# EAGLE design Phoreo (EAGLE 9.6.2)
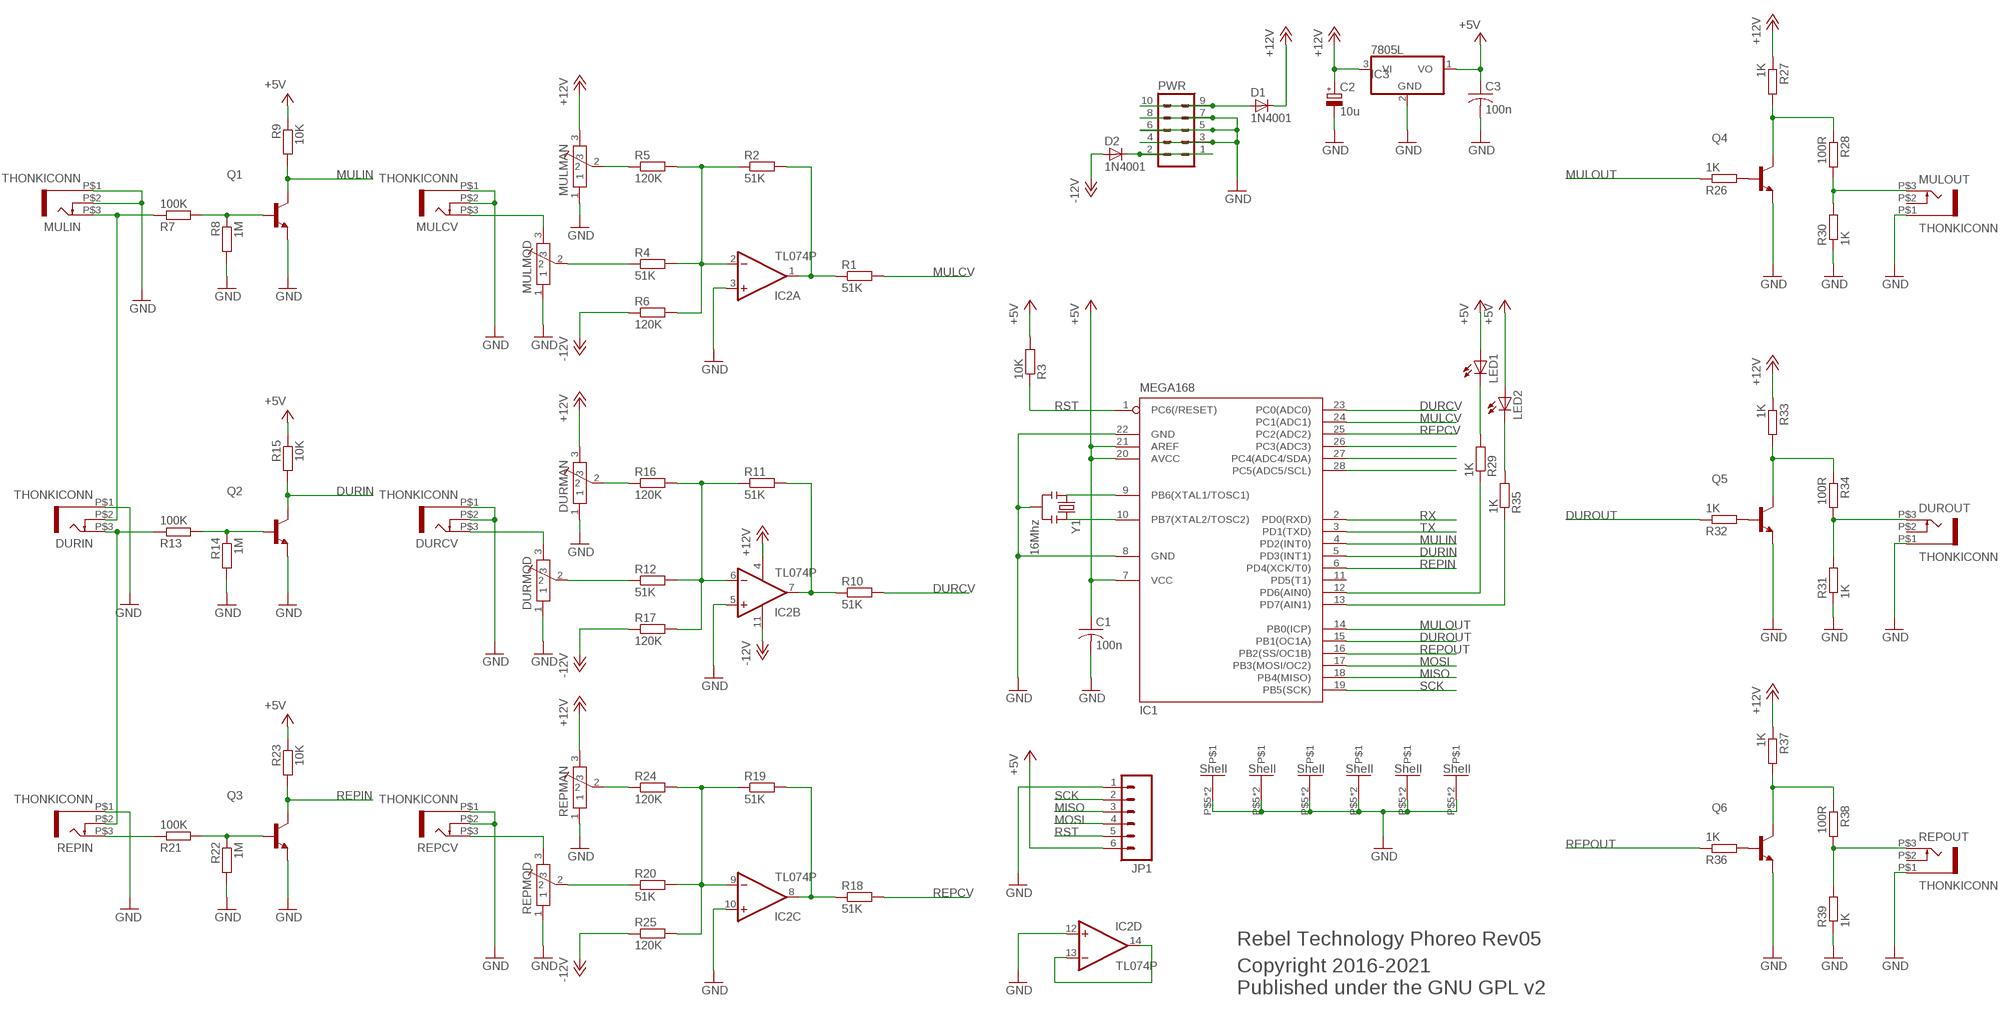
[diagram p0: schematic, sheet 1]

## Parts
C1  100n  C-US050-024X044  [C050-024X044]
C2  10u  CPOL-EUE5-6  [E5-6]
C3  100n  C-US050-024X044  [C050-024X044]
D1  1N4001  DIODE1N4001  [DIODE-1N4001]
D2  1N4001  DIODE1N4001  [DIODE-1N4001]
DURCV  THONKICONN  [THONKICONN]
DURIN  THONKICONN  [THONKICONN]
DURMAN  POT-ALPS-RK09L1140  [POT-ALPS-RK09L1140]
DURMOD  POT-ALPS-RK09L1140  [POT-ALPS-RK09L1140]
DUROUT  THONKICONN  [THONKICONN]
IC1  MEGA168  MEGA8-P  [DIL28-3]
IC2  TL074P  [DIL14]
IC3  7805L  [TO92]
JP1  M06SIP  [1X06]
LED1  LED3MM  [LED3MM]
LED2  LED3MM  [LED3MM]
MULCV  THONKICONN  [THONKICONN]
MULIN  THONKICONN  [THONKICONN]
MULMAN  POT-ALPS-RK09L1140  [POT-ALPS-RK09L1140]
MULMOD  POT-ALPS-RK09L1140  [POT-ALPS-RK09L1140]
MULOUT  THONKICONN  [THONKICONN]
PWR  MA05-2  [MA05-2]
Q1  2N3904-NPN-TO92-EBC  [TO92-EBC]
Q2  2N3904-NPN-TO92-EBC  [TO92-EBC]
Q3  2N3904-NPN-TO92-EBC  [TO92-EBC]
Q4  2N3904-NPN-TO92-EBC  [TO92-EBC]
Q5  2N3904-NPN-TO92-EBC  [TO92-EBC]
Q6  2N3904-NPN-TO92-EBC  [TO92-EBC]
R1  51K  R-EU_0204/7  [0204/7]
R2  51K  R-EU_0204/7  [0204/7]
R3  10K  R-EU_0204/7  [0204/7]
R4  51K  R-EU_0204/7  [0204/7]
R5  120K  R-EU_0204/7  [0204/7]
R6  120K  R-EU_0204/7  [0204/7]
R7  100K  R-EU_0204/7  [0204/7]
R8  1M  R-EU_0204/7  [0204/7]
R9  10K  R-EU_0204/7  [0204/7]
R10  51K  R-EU_0204/7  [0204/7]
R11  51K  R-EU_0204/7  [0204/7]
R12  51K  R-EU_0204/7  [0204/7]
R13  100K  R-EU_0204/7  [0204/7]
R14  1M  R-EU_0204/7  [0204/7]
R15  10K  R-EU_0204/7  [0204/7]
R16  120K  R-EU_0204/7  [0204/7]
R17  120K  R-EU_0204/7  [0204/7]
R18  51K  R-EU_0204/7  [0204/7]
R19  51K  R-EU_0204/7  [0204/7]
R20  51K  R-EU_0204/7  [0204/7]
R21  100K  R-EU_0204/7  [0204/7]
R22  1M  R-EU_0204/7  [0204/7]
R23  10K  R-EU_0204/7  [0204/7]
R24  120K  R-EU_0204/7  [0204/7]
R25  120K  R-EU_0204/7  [0204/7]
R26  1K  R-EU_0204/7  [0204/7]
R27  1K  R-EU_0204/7  [0204/7]
R28  100R  R-EU_0204/7  [0204/7]
R29  1K  R-EU_0204/7  [0204/7]
R30  1K  R-EU_0204/7  [0204/7]
R31  1K  R-EU_0204/7  [0204/7]
R32  1K  R-EU_0204/7  [0204/7]
R33  1K  R-EU_0204/7  [0204/7]
R34  100R  R-EU_0204/7  [0204/7]
R35  1K  R-EU_0204/7  [0204/7]
R36  1K  R-EU_0204/7  [0204/7]
R37  1K  R-EU_0204/7  [0204/7]
R38  100R  R-EU_0204/7  [0204/7]
R39  1K  R-EU_0204/7  [0204/7]
REPCV  THONKICONN  [THONKICONN]
REPIN  THONKICONN  [THONKICONN]
REPMAN  POT-ALPS-RK09L1140  [POT-ALPS-RK09L1140]
REPMOD  POT-ALPS-RK09L1140  [POT-ALPS-RK09L1140]
REPOUT  THONKICONN  [THONKICONN]
Y1  16Mhz  RESONATORPTH  [RESONATOR-PTH]

## Nets
+5V: C1.1 C3.1 IC1.7(VCC) IC1.20(AVCC) IC1.21(AREF) IC3.1(VO) JP1.6 LED1.A LED2.A R3.2 R9.1 R15.1 R23.1
+12V: C2.+ D1.C DURMAN.3 IC2.4(P:V+) IC3.3(VI) MULMAN.3 R27.1 R33.1 R37.1 REPMAN.3
-12V: D2.A IC2.11(P:V-) R6.1 R17.1 R25.1
DURCV: IC1.23(PC0(ADC0)) R10.2
DURIN: IC1.5(PD3(INT1)) Q2.C R15.2
DUROUT: IC1.15(PB1(OC1A)) R32.1
DURSW: DURIN.P$2 MULIN.P$3 R7.1
GND: C1.2 C2.- C3.2 DURCV.P$1 DURCV.P$2 DURIN.P$1 DURMAN.1 DURMAN.P$5 DURMAN.P$6 DURMOD.1 DURMOD.P$5 DURMOD.P$6 DUROUT.P$1 IC1.8(GND) IC1.22(GND) IC2.3(A:+IN) IC2.5(B:+IN) IC2.10(C:+IN) IC2.12(D:+IN) IC3.2(GND) JP1.1 MULCV.P$1 MULCV.P$2 MULIN.P$1 MULIN.P$2 MULMAN.1 MULMAN.P$5 MULMAN.P$6 MULMOD.1 MULMOD.P$5 MULMOD.P$6 MULOUT.P$1 PWR.3 PWR.4 PWR.5 PWR.6 PWR.7 PWR.8 Q1.E Q2.E Q3.E Q4.E Q5.E Q6.E R8.2 R14.2 R22.2 R30.1 R31.1 R39.1 REPCV.P$1 REPCV.P$2 REPIN.P$1 REPMAN.1 REPMAN.P$5 REPMAN.P$6 REPMOD.1 REPMOD.P$5 REPMOD.P$6 REPOUT.P$1 Y1.2
MISO: IC1.18(PB4(MISO)) JP1.3
MOSI: IC1.17(PB3(MOSI/OC2)) JP1.4
MULCV: IC1.24(PC1(ADC1)) R1.2
MULIN: IC1.4(PD2(INT0)) Q1.C R9.2
MULOUT: IC1.14(PB0(ICP)) R26.1
N$1: DURCV.P$3 DURMOD.3
N$2: IC2.6(B:-IN) R11.1 R12.2 R16.2 R17.2
N$3: DURMAN.2 R16.1
N$4: IC2.7(B:OUT) R10.1 R11.2
N$5: DURMOD.2 R12.1
N$7: IC2.9(C:-IN) R19.1 R20.2 R24.2 R25.2
N$8: R24.1 REPMAN.2
N$9: IC2.8(C:OUT) R18.1 R19.2
N$10: R20.1 REPMOD.2
N$11: IC2.13(D:-IN) IC2.14(D:OUT)
N$12: REPCV.P$3 REPMOD.3
N$13: IC1.26(PC3(ADC3))
N$14: IC1.27(PC4(ADC4/SDA))
N$15: IC1.28(PC5(ADC5/SCL))
N$16: IC2.2(A:-IN) R2.1 R4.2 R5.2 R6.2
N$17: MULMAN.2 R5.1
N$18: IC2.1(A:OUT) R1.1 R2.2
N$19: MULMOD.2 R4.1
N$20: IC1.9(PB6(XTAL1/TOSC1)) Y1.1
N$21: IC1.10(PB7(XTAL2/TOSC2)) Y1.3
N$22: MULCV.P$3 MULMOD.3
N$23: LED1.K(C) R29.2
N$24: LED2.K(C) R35.2
N$25: IC1.13(PD7(AIN1)) R35.1
N$26: Q5.B R32.2
N$27: Q1.B R7.2 R8.1
N$28: MULOUT.P$3 R28.2 R30.2
N$29: IC1.12(PD6(AIN0)) R29.1
N$30: DUROUT.P$3 R31.2 R34.2
N$31: Q2.B R13.2 R14.1
N$32: Q5.C R33.2 R34.1
N$33: Q4.B R26.2
N$34: Q6.B R36.2
N$35: R38.2 R39.2 REPOUT.P$3
N$36: DURIN.P$3 R13.1 REPIN.P$2
N$37: Q4.C R27.2 R28.1
N$38: Q6.C R37.2 R38.1
N$39: Q3.B R21.2 R22.1
N$40: D1.A PWR.9 PWR.10
N$41: R21.1 REPIN.P$3
N$42: D2.C PWR.1 PWR.2
REPCV: IC1.25(PC2(ADC2)) R18.2
REPIN: IC1.6(PD4(XCK/T0)) Q3.C R23.2
REPOUT: IC1.16(PB2(SS/OC1B)) R36.1
RST: IC1.1(PC6(/RESET)) JP1.5 R3.1
RX: IC1.2(PD0(RXD))
SCK: IC1.19(PB5(SCK)) JP1.2
TX: IC1.3(PD1(TXD))
Unconnected: DUROUT.P$2 IC1.11(PD5(T1)) MULOUT.P$2 REPOUT.P$2

## Notes on the sheet
- Rebel Technology Phoreo Rev05
- Copyright 2016-2021
  Published under the GNU GPL v2

## Library data of the parts
C1 C3 = rcl:C-US: CAPACITOR, American symbol
C2 = rcl:CPOL-EU: POLARIZED CAPACITOR, European symbol
D1 D2 = Rebel:DIODE: Diode
DURCV DURIN DUROUT MULCV MULIN MULOUT REPCV REPIN REPOUT = Rebel:THONKICONN
DURMAN DURMOD MULMAN MULMOD REPMAN REPMOD = Rebel:POT-ALPS-RK09L
IC1 = atmel:MEGA8-P: MICROCONTROLLER 8 Kbytes FLASH, 1 kbytes SRAM, 512 bytes EEPROM, USART, 4-channel 10 bit ADC, 2-channel 8 bit ADC Pin compatible with Atmega48, ATMega88, ATMega168 Source: avr.lbr; OC_FARNELL: unknown; OC_NEWARK: unknown
IC2 = linear:TL074: OP AMP
IC3 = linear:78*: Positive VOLTAGE REGULATOR Source: http://cache.national.com/ds/LM/LM78L05.pdf http://www.fairchildsemi.com/ds/LM/LM7805.pdf
JP1 = SparkFun:M06: Header 6 Standard 6-pin 0.1" header. Use with straight break away headers (SKU : PRT-00116), right angle break away headers (PRT-00553), swiss pins (PRT-00743), machine pins (PRT-00117), and female headers (PRT-00115). Molex polarized connector foot print use with SKU : PRT-08094 with associated crimp pins and housings. NOTES ON THE VARIANTS LOCK and LOCK_LONGPADS... This footprint was designed to help hold the alignment of a through-hole component (i.e. 6-pin header) while soldering it into place. You may notice that each hole has been shifted either up or down by 0.005 of an inch from it's more standard position (which is a perfectly straight line). This slight alteration caused the pins (the squares in the middle) to touch the edges of the holes. Because they are alternating, it causes a "brace" to hold the component in place. 0.005 has proven to be the perfect amount of "off-center" position when using our standard breakaway headers. Although looks a little odd when you look at the bare footprint, once you have a header in there, the alteration is very hard to notice. Also, if you push a header all the way into place, it is covered up entirely on the bottom side. This idea of altering the position of holes to aid alignment will be further integrated into the Sparkfun Library for other footprints. It can help hold any component with 3 or more connection pins.
LED1 LED2 = Rebel:LED: LED OSRAM: - CHIPLED LG R971, LG N971, LY N971, LG Q971, LY Q971, LO R971, LY R971 LH N974, LH R974 LS Q976, LO Q976, LY Q976 LO Q996 - Hyper CHIPLED LW Q18S LB Q993, LB Q99A, LB R99A - SideLED LS A670, LO A670, LY A670, LG A670, LP A670 LB A673, LV A673, LT A673, LW A673 LH A674 LY A675 LS A676, LA A676, LO A676, LY A676, LW A676 LS A679, LY A679, LG A679 - Hyper Micro SIDELED® LS Y876, LA Y876, LO Y876, LY Y876 LT Y87S - SmartLED LW L88C, LW L88S LB L89C, LB L89S, LG L890 LS L89K, LO L89K, LY L89K LS L896, LA L896, LO L896, LY L896 - TOPLED LS T670, LO T670, LY T670, LG T670, LP T670 LSG T670, LSP T670, LSY T670, LOP T670, LYG T670 LG T671, LOG T671, LSG T671 LB T673, LV T673, LT T673, LW T673 LH T674 LS T676, LA T676, LO T676, LY T676, LB T676, LH T676, LSB T676, LW T676 LB T67C, LV T67C, LT T67C, LS T67K, LO T67K, LY T67K, LW E67C LS E67B, LA E67B, LO E67B, LY E67B, LB E67C, LV E67C, LT E67C LW T67C LS T679, LY T679, LG T679 LS T770, LO T770, LY T770, LG T770, LP T770 LB T773, LV T773, LT T773, LW T773 LH T774 LS E675, LA E675, LY E675, LS T675 LS T776, LA T776, LO T776, LY T776, LB T776 LHGB T686 LT T68C, LB T68C - Hyper Mini TOPLED® LB M676 - Mini TOPLED Santana® LG M470 LS M47K, LO M47K, LY M47K Source: http://www.osram.convergy.de LUXEON: - LUMILED® LXK2-PW12-R00, LXK2-PW12-S00, LXK2-PW14-U00, LXK2-PW14-V00 LXK2-PM12-R00, LXK2-PM12-S00, LXK2-PM14-U00 LXK2-PE12-Q00, LXK2-PE12-R00, LXK2-PE12-S00, LXK2-PE14-T00, LXK2-PE14-U00 LXK2-PB12-K00, LXK2-PB12-L00, LXK2-PB12-M00, LXK2-PB14-N00, LXK2-PB14-P00, LXK2-PB14-Q00 LXK2-PR12-L00, LXK2-PR12-M00, LXK2-PR14-Q00, LXK2-PR14-R00 LXK2-PD12-Q00, LXK2-PD12-R00, LXK2-PD12-S00 LXK2-PH12-R00, LXK2-PH12-S00 LXK2-PL12-P00, LXK2-PL12-Q00, LXK2-PL12-R00 Source: www.luxeon.com KINGBRIGHT: KA-3528ASYC Source: www.kingbright.com
PWR = Rebel:MA05-2: PIN HEADER; OC_FARNELL: unknown; OC_NEWARK: unknown
Q1-Q6 = transistor-neu-to92:*-NPN-: NPN Transistror
R1-R39 = Rebel:R-EU_: RESISTOR, European symbol
Y1 = SparkFun:RESONATOR: Resonator Small SMD resonator. This is the itty bitty 10/20MHz resonators with built in caps. CSTCE10M0G55 and CSTCE20M0V53. Footprint has been reviewed closely but hasn't been tested yet.

## Board
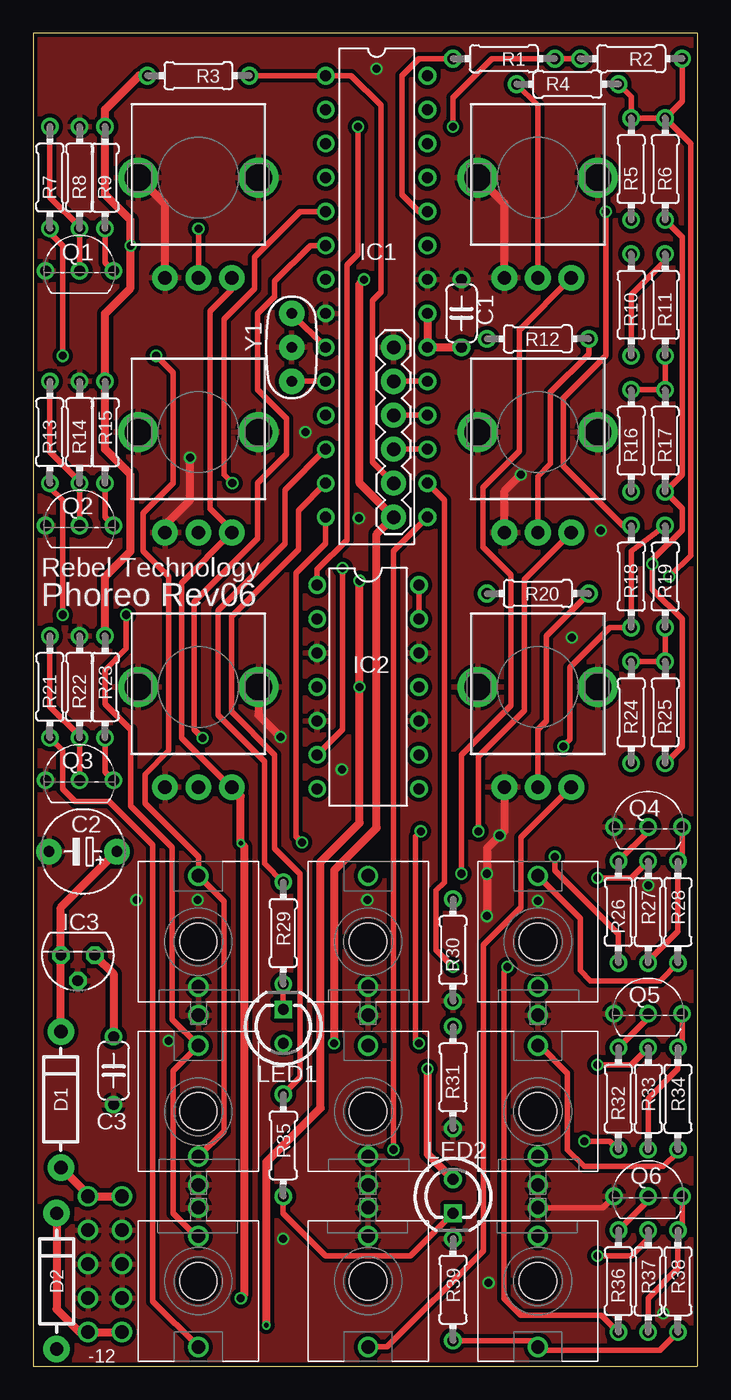
[diagram p1: board, top side]
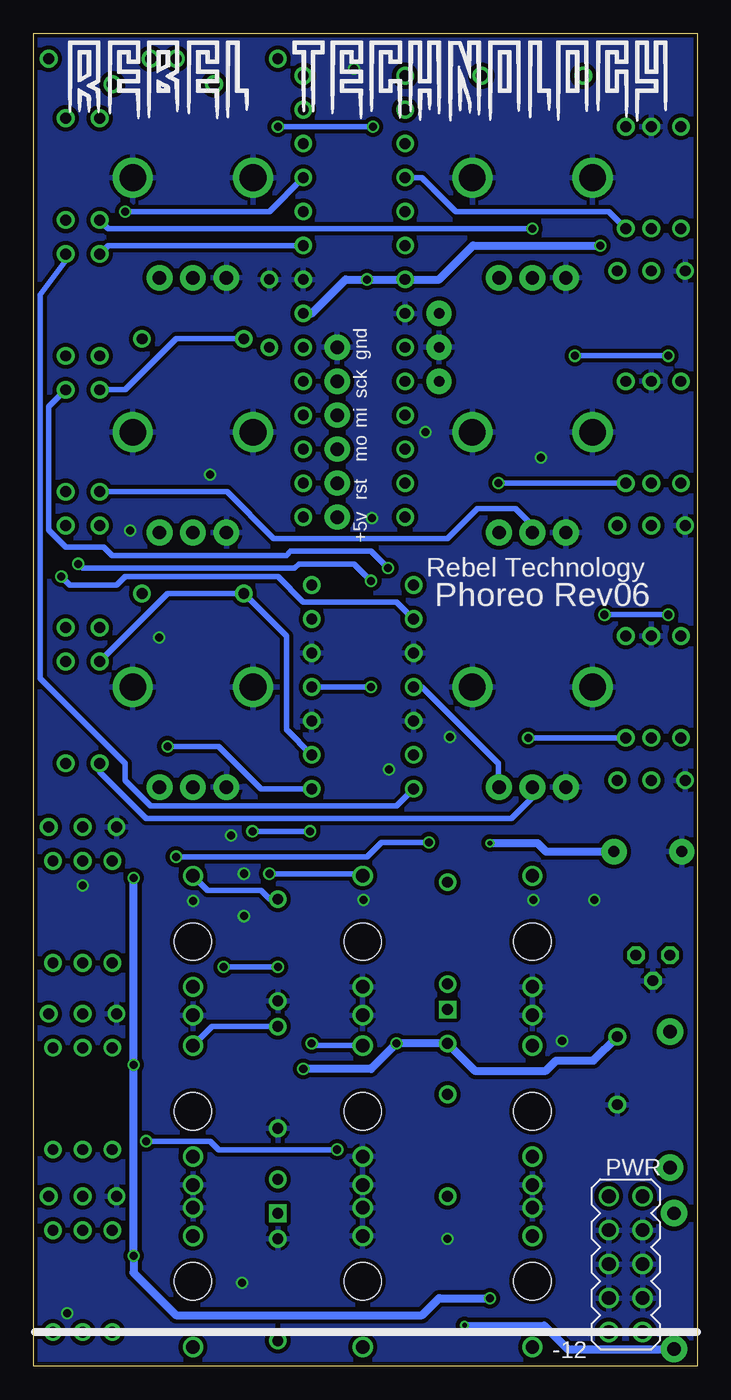
[diagram p2: board, bottom side, seen from below]

Size 49.68 x 99.68 mm. Coordinates in mm from the lower left corner, seen from the top.
Outline: 49.68,99.68 0,99.68 0,0 49.68,0 49.68,99.68
Copper layers (1*16): Top 0.035mm / dielectric 1.5mm / Bottom 0.035mm
Design rules "Fusion_eagle_rule_v1.1 *": minimum track width 6mil, minimum drill 12mil, track to track 6mil, track to pad 6mil, pad to pad 6mil, via to via 6mil, smd to smd 0mil, copper to edge 8mil, drill to drill 8mil, minimum pad ring 10mil, minimum via ring 6mil, stop-mask expansion 2mil, vias tented up to drill 100mil, thermal gap 10mil

### Footprints (pad centres in the part's own frame; a part is rotated, then mirrored left to right if it is on the bottom)
C050-024X044 = drill 0.813: 1 -2.54,0; 2 2.54,0
E5-6 = drill 0.813 pad 1.905: + -2.54,0; - 2.54,0
DIODE-1N4001 = drill 1 pad 1.981: A -5.08,0; C 5.08,0
THONKICONN = drill 1: P$1 0,-5.5; P$2 0,-3.38; P$3 0,4.92 | hole 2.8: 0,0
POT-ALPS-RK09L1140 = drill 1 pad 1.93: 1 -2.5,-7.5; 2 0,-7.5; 3 2.5,-7.5 | drill 2: P$5 -4.5,0; P$6 4.5,0
DIL28-3 = drill 0.813: 1 -16.51,-3.81; 2 -13.97,-3.81; 3 -11.43,-3.81; 4 -8.89,-3.81; 5 -6.35,-3.81; 6 -3.81,-3.81; 7 -1.27,-3.81; 8 1.27,-3.81; 9 3.81,-3.81; 10 6.35,-3.81; 11 8.89,-3.81; 12 11.43,-3.81; 13 13.97,-3.81; 14 16.51,-3.81; 15 16.51,3.81; 16 13.97,3.81; 17 11.43,3.81; 18 8.89,3.81; 19 6.35,3.81; 20 3.81,3.81; 21 1.27,3.81; 22 -1.27,3.81; 23 -3.81,3.81; 24 -6.35,3.81; 25 -8.89,3.81; 26 -11.43,3.81; 27 -13.97,3.81; 28 -16.51,3.81
DIL14 = drill 0.813: 1 -7.62,-3.81; 2 -5.08,-3.81; 3 -2.54,-3.81; 4 0,-3.81; 5 2.54,-3.81; 6 5.08,-3.81; 7 7.62,-3.81; 8 7.62,3.81; 9 5.08,3.81; 10 2.54,3.81; 11 0,3.81; 12 -2.54,3.81; 13 -5.08,3.81; 14 -7.62,3.81
TO92 = drill 0.813 octagon: 1 -1.27,0; 2 0,1.905; 3 1.27,0
1X06 = drill 1.016 pad 1.88: 1 0,0; 2 2.54,0; 3 5.08,0; 4 7.62,0; 5 10.16,0; 6 12.7,0
LED3MM = drill 0.813: A -1.27,0 | drill 0.813 square: K 1.27,0
MA05-2 = drill 1.016: 1 -5.08,-1.27; 2 -5.08,1.27; 3 -2.54,-1.27; 4 -2.54,1.27; 5 0,-1.27; 6 0,1.27; 7 2.54,-1.27; 8 2.54,1.27; 9 5.08,-1.27; 10 5.08,1.27
TO92-EBC = drill 0.813: B 0,-1.27; C 2.54,-1.27; E -2.54,-1.27
0204/7 = drill 0.813: 1 -3.81,0; 2 3.81,0
RESONATOR-PTH = drill 0.8 pad 1.88: 1 -2.54,0; 2 0,0; 3 2.54,0

### Placement (x,y rotation side)
C1  32.03,78.74 90 top
C2  3.71,38.48 180 top
C3  5.99,22.1 270 top
D1  2.06,19.94 90 top
D2  1.74,6.35 90 top
DURCV  25.04,19.05 0 top
DURIN  12.34,19.05 0 top
DURMAN  12.34,69.85 0 top
DURMOD  37.74,69.85 0 top
DUROUT  37.74,19.05 0 top
IC1  25.68,80.01 270 top
IC2  25.04,50.8 270 top
IC3  3.33,30.73 180 top
JP1  26.95,76.2 270 top
LED1  18.69,25.4 90 top
LED2  31.39,12.7 270 top
MULCV  25.04,31.75 0 top
MULIN  12.34,31.75 0 top
MULMAN  12.34,88.9 0 top
MULMOD  37.74,88.9 0 top
MULOUT  37.74,31.75 0 top
PWR  5.36,7.62 90 bottom
Q1  3.45,83.19 0 top
Q2  3.45,64.14 0 top
Q3  3.45,45.09 0 top
Q4  46,41.59 0 top
Q5  46,27.62 0 top
Q6  46,13.97 0 top
R1  35.2,97.79 180 top
R2  44.73,97.79 180 top
R3  12.34,96.52 180 top
R4  39.97,95.89 0 top
R5  44.73,89.53 90 top
R6  47.27,89.53 90 top
R7  1.23,88.9 90 top
R8  3.45,88.9 90 top
R9  5.36,88.9 270 top
R10  44.73,79.38 90 top
R11  47.27,79.38 90 top
R12  37.74,76.83 180 top
R13  1.23,69.85 90 top
R14  3.45,69.85 90 top
R15  5.36,69.85 270 top
R16  44.73,69.22 90 top
R17  47.27,69.22 90 top
R18  44.73,59.05 90 top
R19  47.27,59.05 90 top
R20  37.74,57.78 180 top
R21  1.23,50.8 90 top
R22  3.45,50.8 90 top
R23  5.36,50.8 270 top
R24  44.73,48.9 90 top
R25  47.27,48.9 90 top
R26  43.78,33.97 90 top
R27  46,33.97 270 top
R28  48.22,33.97 270 top
R29  18.69,32.38 270 top
R30  31.39,31.11 90 top
R31  31.39,21.59 90 top
R32  43.78,20 90 top
R33  46,20 270 top
R34  48.22,20 270 top
R35  18.69,16.51 270 top
R36  43.78,6.35 90 top
R37  46,6.35 270 top
R38  48.22,6.35 270 top
R39  31.39,5.71 270 top
REPCV  25.04,6.35 180 top
REPIN  12.34,6.35 180 top
REPMAN  12.34,50.8 0 top
REPMOD  37.74,50.8 0 top
REPOUT  37.74,6.35 180 top
Y1  19.33,76.2 270 top

### Tracks (layer width: path | path; a pad name or v marks a point on that pad's centre or on a via)
+5V  (via drill 0.6)
  Top 0.61: R23.1 5.36,59.05 7.26,60.96 7.26,66.67 5.36,68.58 R15.1 5.36,78.74 7.26,80.64 v7.26,83.82 7.26,85.72 5.36,87.63 R9.1 5.36,93.98 7.9,96.52 R3.2 | IC1.21 IC1.20 C1.1 | v22.5,24.13 22.5,37.08 25.68,40.26 25.68,62.23 JP1.6 24.41,66.04 24.41,80.96 v24.73,81.28 | v29.49,22.23 29.49,15.88 LED2.A | IC3.1 5.99,29.34 C3.1
  Bottom 0.61: IC1.21 28.85,78.74 26.31,81.28 v24.73,81.28 IC1.7 19.33,81.28 16.79,83.82 v7.26,83.82 | v29.49,22.23 24.41,22.23 v22.5,24.13 LED1.A 16.66,22.1 11.33,22.1 10.57,22.86 7.77,22.86 C3.1
+12V  (via drill 0.35, 0.6)
  Top 0.406: R37.1 46,9.53 44.73,8.26 v42.19,8.26 | v42.19,22.54 44.73,22.54 R33.1 | v42.19,36.51 44.73,36.51 R27.1 | MULMAN.3 14.84,80.51 13.23,78.9 13.23,64.14 14.84,62.52 DURMAN.3 11.07,58.58 11.07,46.99 14.76,43.3 REPMAN.3
  Top 0.61: v15.52,5.08 15.77,5.33 15.77,38.86 v15.52,39.12 15.52,42.62 REPMAN.3 | D1.C IC3.3 2.06,34.29 C2.+
  Bottom 0.406: IC2.4 20.6,50.8 14.88,45.09 14.88,43.34 REPMAN.3
  Bottom 0.61: v42.19,36.51 v42.19,22.54 v42.19,8.26 42.19,6.99 39.01,3.81 20.6,3.81 19.33,5.08 v15.52,5.08 | C2.+ 11.33,38.48 11.96,39.12 v15.52,39.12
-12V  (via drill 0.35, 0.6)
  Top 0.406: R25.1 48.54,46.35 48.54,55.88 46.32,58.1 v46.32,60.01 46.32,60.33 48.54,62.55 48.54,64.14 R17.1 48.54,66.67 48.54,84.45 R6.1
  Top 0.61: v24.41,58.74 v24.41,50.8 24.41,40.64 21.49,37.72 21.49,19.3 17.42,15.24 v17.42,3.05
  Bottom 0.406: IC2.11 v24.41,50.8 | v24.41,58.74 25.68,60.01 29.81,60.01 30.12,59.69 46,59.69 v46.32,60.01
  Bottom 0.61: v17.42,3.05 17.4,3.02 11.46,3.02 9.71,1.27 D2.A
DURCV
  Bottom 0.406: R10.2 44.09,83.82 IC1.23
DURIN  (via drill 0.6)
  Top 0.406: R15.2 5.36,63.5 Q2.C | IC1.5 19.96,86.36 16.54,82.93 16.54,80.58 14.25,78.3 14.25,66.67 v14.88,66.04
  Bottom 0.406: v14.88,66.04 R15.2
DUROUT  (via drill 0.6)
  Top 0.406: v26.95,16.19 26.95,60.96 IC1.15 | v41.24,16.83 43.14,16.83 R32.1
  Bottom 0.406: v41.24,16.83 36.47,16.83 35.84,16.19 v26.95,16.19
DURSW  (via drill 0.6)
  Top 0.406: DURIN.P$2 14.25,17.57 14.25,34.77 MULIN.P$3 12.34,38.1 8.34,42.1 8.34,44.26 10.12,46.04 10.12,59.05 8.22,60.96 8.22,63.82 10.44,66.04 10.44,74.3 v9.17,75.56 | R7.1 1.23,84.77 2.18,83.82 v2.18,75.56
  Bottom 0.406: v2.18,75.56 v9.17,75.56
GND  (via drill 0.6)
  Top 0.406: REPOUT.P$1 42.61,11.85 Q6.E
  Top 0.61: DURMOD.1 35.24,65.44 v36.47,66.67 | MULMOD.P$5 33.3,88.9 35.2,87 35.2,81.44 MULMOD.1 | MULMAN.P$5 9.84,86.9 MULMAN.1 | DURMAN.1 9.84,62.91 11.71,64.77 v11.71,67.94 | REPMAN.P$6 16.84,48.71 v18.5,47.05 | REPMOD.1 35.24,40.05 v34.89,39.69 33.93,38.73 v33.93,36.83 v33.93,33.66
  other vias: 24.35,63.44 12.28,34.86 24.98,34.86 23.08,44.64 34.06,6.22 37.74,34.8 40.28,54.48 42.44,62.48 25.68,97.03 10.12,24.32 7.71,34.86 20.35,69.85 47.14,3.94 18.69,9.53 46,35.94
  pour Bottom (isolate 0.305): 51.08,-0.64 0.28,-0.64 -0.36,100.97 50.44,100.97
  pour Top (isolate 0.305): 50.44,-1.27 -0.36,-1.27 -0.99,100.33 49.81,100.33
MISO
  Top 0.406: JP1.3 IC1.18
MOSI
  Top 0.406: JP1.4 IC1.17
MULCV
  Top 0.406: IC1.24 28.85,86.36 27.58,87.63 27.58,96.52 28.85,97.79 R1.2
MULIN
  Top 0.406: R9.2 5.36,82.55 Q1.C
  Bottom 0.406: R9.2 6.63,86.36 18.06,86.36 20.6,88.9 IC1.4
MULOUT  (via drill 0.6)
  Top 0.406: R26.1 43.78,32.32 39.01,37.08 v39.01,38.1 | v20.09,39.18 19.65,39.62 19.65,59.31 21.87,61.53 IC1.14
  Bottom 0.406: v39.01,38.1 24.73,38.1 23.65,39.18 v20.09,39.18
N$1  (via drill 0.6)
  Top 0.406: v28.85,24.13 28.6,24.38 28.6,39.62 v28.98,40.01 | v33.3,40.01 33.3,45.59 36.73,49.02 36.73,58.83 DURMOD.3
  Bottom 0.406: DURCV.P$3 28.69,23.97 v28.85,24.13 | v28.98,40.01 v33.3,40.01
N$2  (via drill 0.6)
  Top 0.406: R16.2 R17.2 R11.1 | v23.14,59.69 23.14,47.62 IC2.6
  Bottom 0.406: R12.2 39.01,76.83 42.82,73.03 R16.2 | v23.14,59.69 24.41,60.96 30.44,60.96 30.76,60.64 43.78,60.64 44.41,61.28 47.27,61.28 48.54,62.55 48.54,71.75 R17.2
N$3
  Bottom 0.406: DURMAN.2 12.34,62.87 13.61,64.14 16.47,64.14 18.69,61.91 31.71,61.91 35.2,65.41 R16.1
N$4
  Top 0.406: R10.1 44.73,80.14 47.27,82.68 R11.2
  Bottom 0.406: R11.2 47.27,82.68 49.17,80.14 49.17,51.44 42.82,45.09 42.82,43.81 40.92,41.91 22.5,41.91 IC2.7
N$5
  Top 0.406: DURMOD.2 37.74,66.55 38.7,67.5 38.7,72.83 41.55,75.69 R12.1
N$7
  Top 0.406: R24.2 R25.2 R19.1
  Bottom 0.406: R24.2 39.65,57.78 R20.2 30.76,54.61 30.76,47.62 IC2.9
N$8
  Bottom 0.406: REPMAN.2 12.34,42.55 13.93,40.96 41.24,40.96 44.73,44.45 R24.1
N$9  (via drill 0.6)
  Top 0.406: R19.2 44.73,60.96 R18.1 43.14,55.24 40.16,52.26 40.16,46.86 v39.65,46.35
  Bottom 0.406: v39.65,46.35 35.84,46.35 32.66,43.18 IC2.8
N$10
  Top 0.406: REPMOD.2 37.74,47.62 38.38,48.26 38.38,54.61 R20.1
N$11
  Top 0.406: IC2.13 IC2.14
N$12
  Top 0.406: REPCV.P$3 26.47,1.43 33.68,8.64 33.68,31.5 36.47,34.29 36.47,39.53 REPMOD.3
N$16  (via drill 0.6)
  Top 0.406: R6.2 49.17,91.44 49.17,60.64 v47.59,59.05 | R6.2 R5.2 44.73,94.93 R4.2 | R6.2 48.54,94.61 R2.1
  Bottom 0.406: v47.59,59.05 46.95,58.42 43.46,58.42 42.82,59.05 31.39,59.05 29.49,57.15 22.5,57.15 IC2.2
N$17  (via drill 0.6)
  Top 0.406: MULMAN.2 v12.34,85.09
  Bottom 0.406: v12.34,85.09 44.09,85.09 R5.1
N$18  (via drill 0.6)
  Top 0.406: v24.28,92.71 24.28,83.19 23.46,82.36 23.46,61.78 21.23,59.56 IC2.1 | R2.2 R1.1 34.32,97.79 31.39,94.87 v31.39,92.71
  Bottom 0.406: v24.28,92.71 v31.39,92.71
N$19
  Top 0.406: MULMOD.2 37.74,94.3 R4.1
N$20
  Top 0.406: Y1.1 IC1.9
N$21
  Top 0.406: Y1.3 IC1.10
N$22  (via drill 0.6)
  Top 0.406: v32.03,36.83 32.03,45.72 35.71,49.4 35.71,59.18 33.62,61.28 33.62,65.72 36.35,68.45 36.35,77.5 MULMOD.3
  Bottom 0.406: v32.03,36.83 25.2,36.83 MULCV.P$3
N$23
  Top 0.406: LED1.K R29.2
N$24
  Top 0.406: R35.2 18.69,11.43 21.87,8.26 28.22,8.26 LED2.K
N$25
  Top 0.406: IC1.13 19.84,64.01 19.84,61.09 14.82,56.07 14.82,48.96 18.06,45.72 18.06,38.73 19.96,36.83 19.96,21.59 R35.1
N$26
  Top 0.406: Q5.B 46,26.04 R32.2
N$27
  Top 0.406: R7.2 1.23,87.44 3.45,85.22 R8.1 Q1.B
N$28
  Top 0.406: R28.2 46.89,28.83 41.68,28.83 40.92,29.59 40.92,33.49 MULOUT.P$3
  Bottom 0.406: R30.2 32.03,34.92 32.66,35.56 36.63,35.56 MULOUT.P$3
N$29
  Top 0.406: IC1.12 18.82,65.53 18.82,61.53 13.81,56.52 13.81,48.7 17.3,45.21 17.3,37.59 R29.1
N$30
  Top 0.406: DUROUT.P$3 37.9,23.97 39.97,21.91 39.97,16.19 41.24,14.92 46.63,14.92 46.95,14.92 47.14,14.92 48.22,16 R34.2
  Bottom 0.406: R31.2 36.31,25.4 DUROUT.P$3
N$31
  Top 0.406: Q2.B R14.1 3.45,66.17 1.23,68.39 R13.2
N$32
  Top 0.406: R33.2 46,20 48.22,22.23 R34.1 48.54,24.13 Q5.C
N$33
  Top 0.406: Q4.B 46,40.01 R26.2
N$34
  Top 0.406: R36.2 46,12.38 Q6.B
N$35
  Top 0.406: R39.2 37.27,1.91 REPOUT.P$3 38,1.18 46.86,1.18 R38.2
N$36  (via drill 0.6)
  Top 0.406: R13.1 1.23,65.72 2.18,64.77 v2.18,56.2 | v6.95,56.2 6.95,53.66 5.36,52.07 5.36,49.53 7.26,47.62 7.26,41.91 10.38,38.8 10.38,25.94 DURIN.P$3 10.44,22.07 10.44,11.43 12.14,9.73 REPIN.P$2
  Bottom 0.406: v2.18,56.2 v6.95,56.2
N$37
  Top 0.406: Q4.C 48.54,38.1 R28.1 48.22,32.51 46,30.29 R27.2
N$38
  Top 0.406: R37.2 46,5.08 48.22,7.3 R38.1 48.54,10.48 Q6.C
N$39
  Top 0.406: Q3.B R22.1 3.45,47.12 1.23,49.34 R21.2
N$40
  Top 0.61: D1.A 4.09,12.83 PWR.9 PWR.10
N$41
  Top 0.406: REPIN.P$3 8.92,4.86 8.92,38.99 5.68,42.23 3.14,42.23 2.18,43.18 2.18,46.04 R21.1
N$42
  Top 0.61: D2.C 1.74,4.25 3.45,2.54 PWR.1 PWR.2
REPCV  (via drill 0.6)
  Top 0.406: R18.2 44.09,62.87 39.65,67.31 39.65,72.39 42.82,75.56 v42.82,86.36
  Bottom 0.406: v42.82,86.36 32.03,86.36 IC1.25
REPIN  (via drill 0.6)
  Top 0.406: R23.2 5.36,44.45 Q3.C | IC1.6 20.73,83.82 18.06,81.15 18.06,80.01 16.79,78.74 16.79,73.03 18.95,70.87 18.95,68.2 16.79,66.04 16.79,61.91 12.03,57.15 12.03,47.62 v12.66,46.99
  Bottom 0.406: v12.66,46.99 R23.2
REPOUT  (via drill 0.6)
  Top 0.406: v35.46,29.84 35.46,29.72 35.2,29.46 35.2,5.08 36.47,3.81 42.51,3.81 R36.1 | IC1.16 30.76,64.77 30.76,36.2 30.12,35.56 30.12,31.11 v31.39,29.84
  Bottom 0.406: v35.46,29.84 v31.39,29.84
RST
  Top 0.406: JP1.5 25.36,67.63 25.36,79.69 26,80.33 26,94.3 23.77,96.52 IC1.1 R3.1
SCK
  Top 0.406: JP1.2 IC1.19

### Text on the board
tPlace: Rebel Technology | Phoreo Rev06 | -12
bPlace: gnd | sck | mi | mo | rst | +5v | Rebel Technology | Phoreo Rev06 | -12
tNames: Y1